# EAGLE schematic pwr-rel-br (EAGLE 6.5.0)
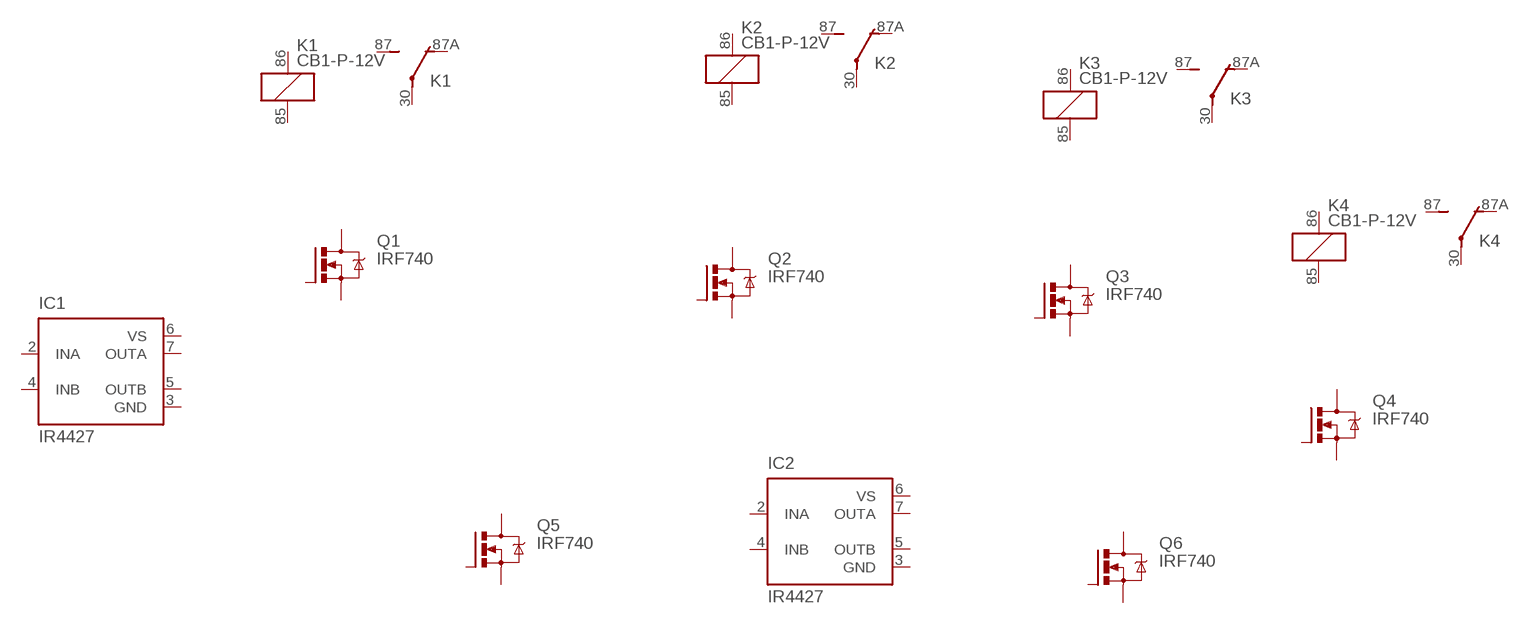
[diagram p0: schematic, sheet 1]

## Parts
IC1  IR4427  [DIL08]
IC2  IR4427  [DIL08]
K1  CB1-P-12V  [CB1]
K2  CB1-P-12V  [CB1]
K3  CB1-P-12V  [CB1]
K4  CB1-P-12V  [CB1]
Q1  IRF740  [TO220BV]
Q2  IRF740  [TO220BV]
Q3  IRF740  [TO220BV]
Q4  IRF740  [TO220BV]
Q5  IRF740  [TO220BV]
Q6  IRF740  [TO220BV]
Unconnected: IC1.2(INA) IC1.4(INB) IC1.5(OUTB) IC1.7(OUTA) IC2.2(INA) IC2.4(INB) IC2.5(OUTB) IC2.7(OUTA) K1.30(2:P) K1.85 K1.86 K1.87(2:S) K1.87A(2:O) K2.30(2:P) K2.85 K2.86 K2.87(2:S) K2.87A(2:O) K3.30(2:P) K3.85 K3.86 K3.87(2:S) K3.87A(2:O) K4.30(2:P) K4.85 K4.86 K4.87(2:S) K4.87A(2:O) Q1.D Q1.G Q1.S Q2.D Q2.G Q2.S Q3.D Q3.G Q3.S Q4.D Q4.G Q4.S Q5.D Q5.G Q5.S Q6.D Q6.G Q6.S

## Power pins joined to a net without a drawn wire
GND: IC1.3(GND) IC2.3(GND)
VS: IC1.6(VS) IC2.6(VS)

## Library data of the parts
IC1 IC2 = ir:IR4427: DUAL LOW SIDE DRIVER Source: ID4426.pdf; MF: INTERNATIONAL RECTIFIER(IR); MPN: IR4427; OC_FARNELL: 1023267; OC_NEWARK: 27C6914
K1-K4 = relay:CB1*: HIGH POWER AUTOMOTIVE RELAY Form C NAiS Source: http://www.mew-europe.com/.. en_ds_61202_0000.pdf; MF: AROMAT/ MATSUSHITA; MPN: CB1-P-12V; OC_FARNELL: unknown; OC_NEWARK: 52F9201
Q1-Q6 = transistor-power:IRF740: N-CHANNEL MOS FET